# Altium project Smart Stepper Fin.PrjPcb
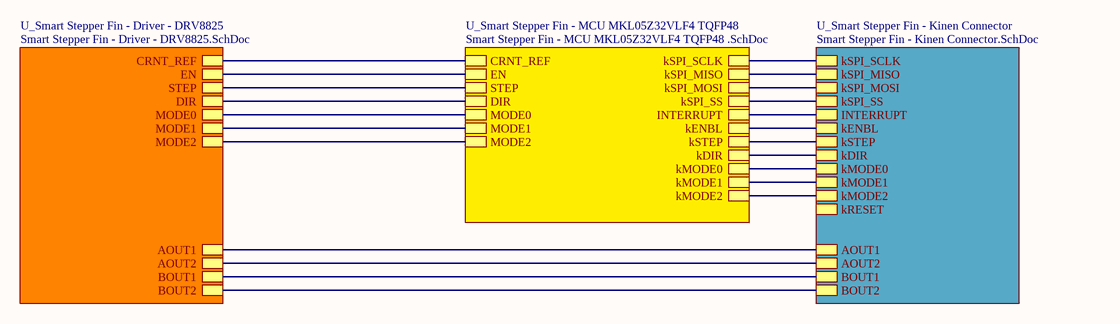
[diagram p0: Smart Stepper Fin - System.SchDoc]
4 sheets, 30 parts. Net scope: hierarchical (ports join the sheet entries above them; power ports are global).
Board file: Smart Stepper Fin R1.0.PcbDoc
Sheets:
  Smart Stepper Fin - System.SchDoc
    U_Smart Stepper Fin - Driver - DRV8825 = Smart Stepper Fin - Driver - DRV8825.SchDoc
    U_Smart Stepper Fin - MCU MKL05Z32VLF4 TQFP48 = Smart Stepper Fin - MCU MKL05Z32VLF4 TQFP48 .SchDoc
    U_Smart Stepper Fin - Kinen Connector = Smart Stepper Fin - Kinen Connector.SchDoc

## Sheet Smart Stepper Fin - System.SchDoc
size A

### Sub-sheets
U_Smart Stepper Fin - Driver - DRV8825 = Smart Stepper Fin - Driver - DRV8825.SchDoc: AOUT1, AOUT2, BOUT1, BOUT2, CRNT_REF, EN, STEP, DIR, MODE0, MODE1, MODE2
U_Smart Stepper Fin - Kinen Connector = Smart Stepper Fin - Kinen Connector.SchDoc: AOUT1, AOUT2, BOUT1, BOUT2, kRESET, kENBL, kSTEP, kDIR, kMODE0, kMODE1, kMODE2, INTERRUPT, kSPI_MOSI, kSPI_MISO, kSPI_SCLK, kSPI_SS
U_Smart Stepper Fin - MCU MKL05Z32VLF4 TQFP48 = Smart Stepper Fin - MCU MKL05Z32VLF4 TQFP48 .SchDoc: CRNT_REF, EN, STEP, DIR, MODE0, MODE1, MODE2, INTERRUPT, kSPI_MOSI, kSPI_MISO, kSPI_SCLK, kSPI_SS, kENBL, kSTEP, kDIR, kMODE0, kMODE1, kMODE2

### Nets
AOUT1: sheet U_Smart Stepper Fin - Driver - DRV8825/AOUT1, sheet U_Smart Stepper Fin - Kinen Connector/AOUT1
AOUT2: sheet U_Smart Stepper Fin - Driver - DRV8825/AOUT2, sheet U_Smart Stepper Fin - Kinen Connector/AOUT2
BOUT1: sheet U_Smart Stepper Fin - Driver - DRV8825/BOUT1, sheet U_Smart Stepper Fin - Kinen Connector/BOUT1
BOUT2: sheet U_Smart Stepper Fin - Driver - DRV8825/BOUT2, sheet U_Smart Stepper Fin - Kinen Connector/BOUT2
kSPI_MISO: sheet U_Smart Stepper Fin - MCU MKL05Z32VLF4 TQFP48/kSPI_MISO, sheet U_Smart Stepper Fin - Kinen Connector/kSPI_MISO
kSPI_MOSI: sheet U_Smart Stepper Fin - MCU MKL05Z32VLF4 TQFP48/kSPI_MOSI, sheet U_Smart Stepper Fin - Kinen Connector/kSPI_MOSI
NetKINEN1_1: sheet U_Smart Stepper Fin - MCU MKL05Z32VLF4 TQFP48/kSPI_SS, sheet U_Smart Stepper Fin - Kinen Connector/kSPI_SS
NetKINEN1_3: sheet U_Smart Stepper Fin - MCU MKL05Z32VLF4 TQFP48/kSPI_SCLK, sheet U_Smart Stepper Fin - Kinen Connector/kSPI_SCLK
NetKINEN1_14: sheet U_Smart Stepper Fin - MCU MKL05Z32VLF4 TQFP48/INTERRUPT, sheet U_Smart Stepper Fin - Kinen Connector/INTERRUPT
NetKINEN1_15: sheet U_Smart Stepper Fin - MCU MKL05Z32VLF4 TQFP48/kSTEP, sheet U_Smart Stepper Fin - Kinen Connector/kSTEP
NetKINEN1_16: sheet U_Smart Stepper Fin - MCU MKL05Z32VLF4 TQFP48/kDIR, sheet U_Smart Stepper Fin - Kinen Connector/kDIR
NetKINEN1_17: sheet U_Smart Stepper Fin - MCU MKL05Z32VLF4 TQFP48/kENBL, sheet U_Smart Stepper Fin - Kinen Connector/kENBL
NetKINEN1_18: sheet U_Smart Stepper Fin - MCU MKL05Z32VLF4 TQFP48/kMODE0, sheet U_Smart Stepper Fin - Kinen Connector/kMODE0
NetKINEN1_19: sheet U_Smart Stepper Fin - MCU MKL05Z32VLF4 TQFP48/kMODE1, sheet U_Smart Stepper Fin - Kinen Connector/kMODE1
NetKINEN1_21: sheet U_Smart Stepper Fin - MCU MKL05Z32VLF4 TQFP48/kMODE2, sheet U_Smart Stepper Fin - Kinen Connector/kMODE2
NetR2_2: sheet U_Smart Stepper Fin - Driver - DRV8825/CRNT_REF, sheet U_Smart Stepper Fin - MCU MKL05Z32VLF4 TQFP48/CRNT_REF
NetR3_2: sheet U_Smart Stepper Fin - Driver - DRV8825/MODE2, sheet U_Smart Stepper Fin - MCU MKL05Z32VLF4 TQFP48/MODE2
NetU1_20: sheet U_Smart Stepper Fin - Driver - DRV8825/DIR, sheet U_Smart Stepper Fin - MCU MKL05Z32VLF4 TQFP48/DIR
NetU1_21: sheet U_Smart Stepper Fin - Driver - DRV8825/EN, sheet U_Smart Stepper Fin - MCU MKL05Z32VLF4 TQFP48/EN
NetU1_22: sheet U_Smart Stepper Fin - Driver - DRV8825/STEP, sheet U_Smart Stepper Fin - MCU MKL05Z32VLF4 TQFP48/STEP
NetU1_24: sheet U_Smart Stepper Fin - Driver - DRV8825/MODE0, sheet U_Smart Stepper Fin - MCU MKL05Z32VLF4 TQFP48/MODE0
NetU1_25: sheet U_Smart Stepper Fin - Driver - DRV8825/MODE1, sheet U_Smart Stepper Fin - MCU MKL05Z32VLF4 TQFP48/MODE1

## Sheet Smart Stepper Fin - Driver - DRV8825.SchDoc
size A
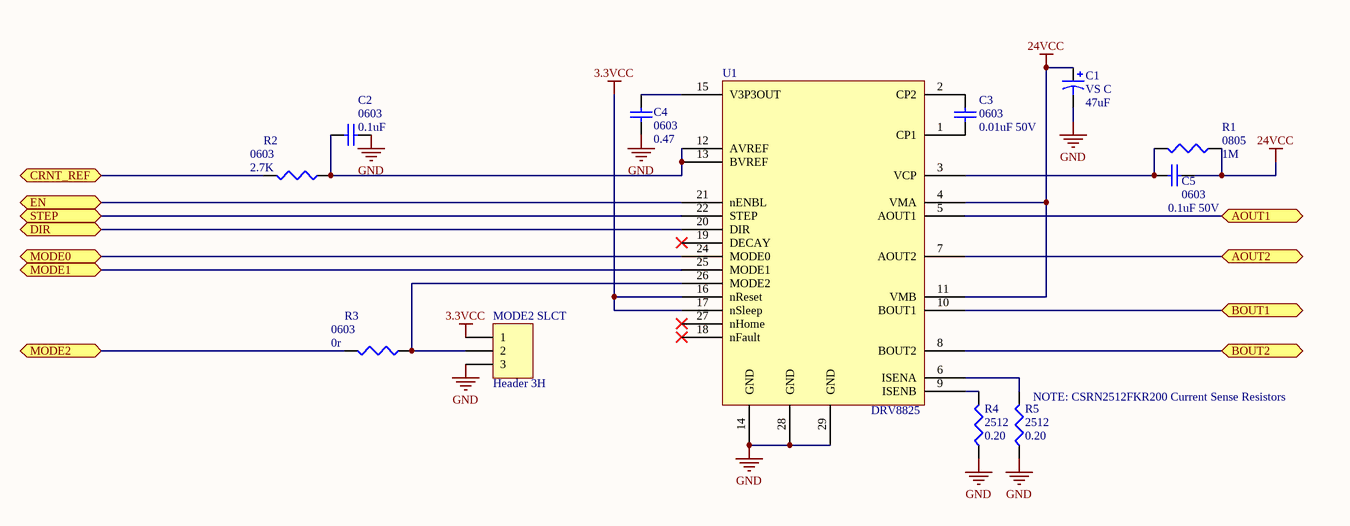
[diagram p1: Smart Stepper Fin - Driver - DRV8825.SchDoc]

### Parts
C1  VS C  value 47uF  [Panasonic VS C]
C2  0603  value 0.1uF  [1608[0603]]
C3  0603  value 0.01uF 50V  [1608[0603]]
C4  0603  value 0.47  [1608[0603]]
C5  0603  value 0.1uF 50V  [1608[0603]]
MODE2_SLCT  Header 3H  [HDR1X3H]
R1  0805  value 1M  [J1-0603]
R2  0603  value 2.7K  [J1-0603]
R3  0603  value 0r  [J1-0603]
R4  2512  value 0.20  [Resistor2512]
R5  2512  value 0.20  [Resistor2512]
U1  DRV8825  [DRV8825]

### Ports
AOUT1, AOUT2, BOUT1, BOUT2, CRNT_REF, DIR, EN, MODE0, MODE1, MODE2, STEP

### Nets
3.3VCC: MODE2_SLCT.1 U1.16(nReset) U1.17(nSleep)
24VCC: C1.1 C5.1 R1.1 U1.4(VMA) U1.11(VMB)
GND: C1.2 C2.1 C4.1 MODE2_SLCT.3 R4.1 R5.1 U1.14(GND) U1.28(GND) U1.29(GND)
AOUT1: U1.5(AOUT1) ; port AOUT1
AOUT2: U1.7(AOUT2) ; port AOUT2
BOUT1: U1.10(BOUT1) ; port BOUT1
BOUT2: U1.8(BOUT2) ; port BOUT2
NetC2_2: C2.2 R2.1 U1.12(AVREF) U1.13(BVREF)
NetC3_1: C3.1 U1.1(CP1)
NetC3_2: C3.2 U1.2(CP2)
NetC4_2: C4.2 U1.15(V3P3OUT)
NetC5_2: C5.2 R1.2 U1.3(VCP)
NetMODE2_SLCT_2: MODE2_SLCT.2 R3.1 U1.26(MODE2)
NetR2_2: R2.2 ; port CRNT_REF
NetR3_2: R3.2 ; port MODE2
NetR4_2: R4.2 U1.9(ISENB)
NetR5_2: R5.2 U1.6(ISENA)
NetU1_20: U1.20(DIR) ; port DIR
NetU1_21: U1.21(nENBL) ; port EN
NetU1_22: U1.22(STEP) ; port STEP
NetU1_24: U1.24(MODE0) ; port MODE0
NetU1_25: U1.25(MODE1) ; port MODE1

Not connected (* = marked no-connect by the designer): U1 18(nFault)* 19(DECAY)* 23(NC) 27(nHome)*

### Notes on the sheet
- (near R5) NOTE: CSRN2512FKR200 Current Sense Resistors

### Library data of the parts
C1 = Cap Pol1: Polarized Capacitor (Radial); Published: 8-Jun-2000; LatestRevisionDate: 17-Jul-2002; LatestRevisionNote: Re-released for DXP Platform.; PackageReference: RB7.6-15; Publisher: Altium Limited; PackageDescription: Polarized Capacitor (Radial); 2 Leads
C2-C5 = Cap Semi: Capacitor (Semiconductor SIM Model); Published: 8-Jun-2000; LatestRevisionDate: 29-May-2009; LatestRevisionNote: IPC-7351 Footprint Added.; PackageReference: C1206; Publisher: Altium Limited; PackageDescription: Chip Capacitor
MODE2_SLCT = Header 3H: Header, 3-Pin, Right Angle; LatestRevisionDate: 17-Jul-2002; LatestRevisionNote: Re-released for DXP Platform.; Publisher: Altium Limited
R1-R5 = Res3: Resistor; Published: 8-Jun-2000; LatestRevisionDate: 29-May-2009; LatestRevisionNote: IPC-7351 Footprint Added.; PackageReference: J1-0603; Publisher: Altium Limited; PackageDescription: Chip Resistor
U1 = DRV8825: DRV8825 Ti Stepper Driver

## Sheet Smart Stepper Fin - MCU MKL05Z32VLF4 TQFP48 .SchDoc
size A
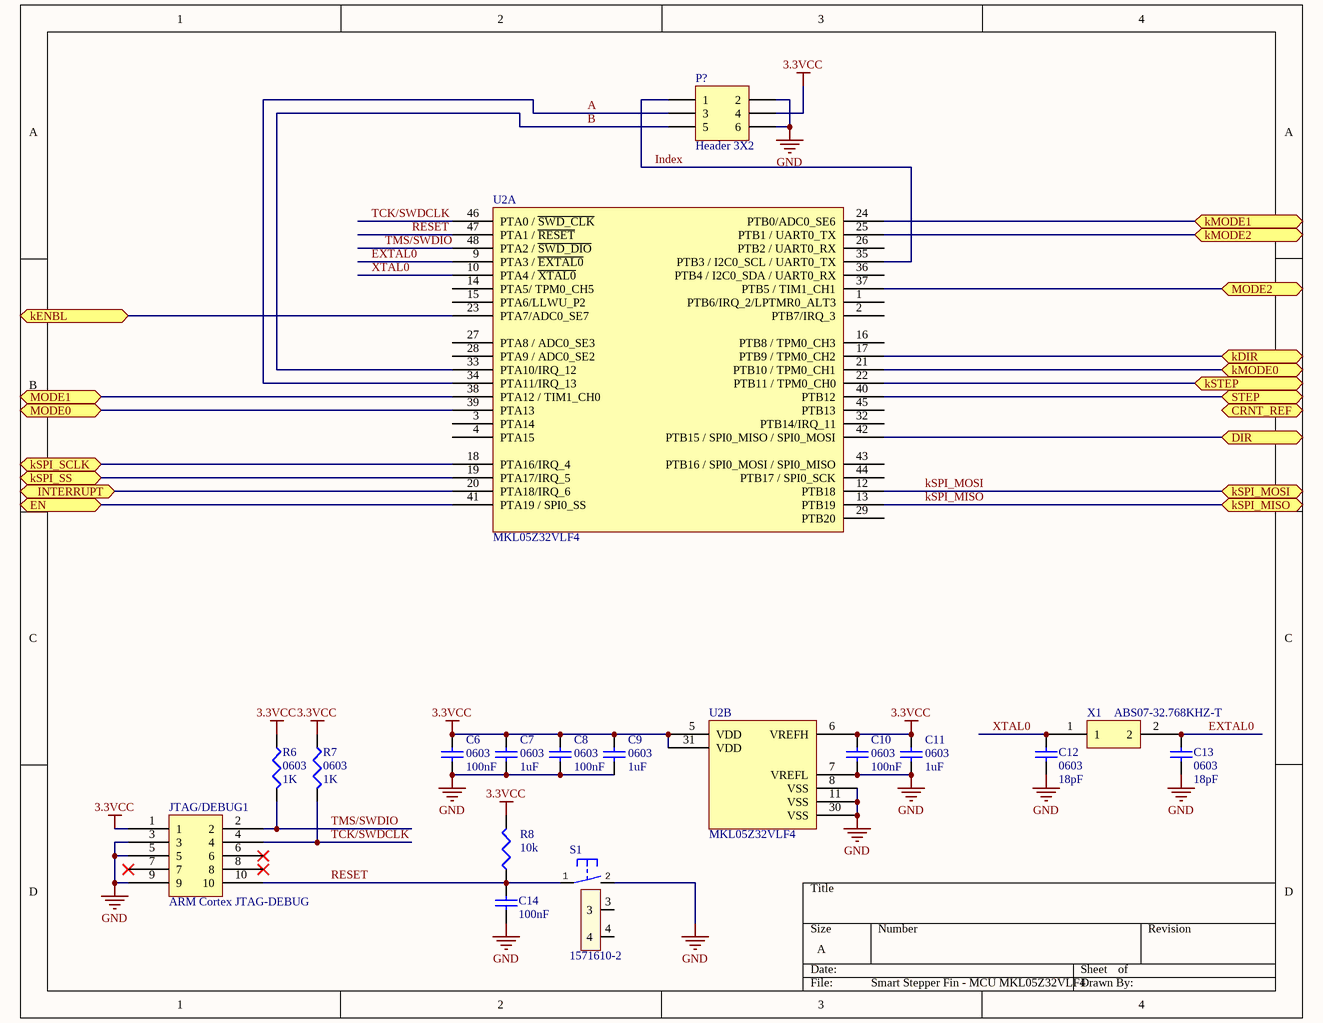
[diagram p2: Smart Stepper Fin - MCU MKL05Z32VLF4 TQFP48 .SchDoc]

### Parts
C6  0603  value 100nF  [1608[0603]]
C7  0603  value 1uF  [1608[0603]]
C8  0603  value 100nF  [1608[0603]]
C9  0603  value 1uF  [1608[0603]]
C10  0603  value 100nF  [1608[0603]]
C11  0603  value 1uF  [1608[0603]]
C12  0603  value 18pF  [1608[0603]]
C13  0603  value 18pF  [1608[0603]]
C14  value 100nF  [1608[0603]]  (hidden comment: Cap Semi)
ENC  Header 3X2  [HDR2X3 Shrouded - Molex 0901301106]
JTAG/DEBUG1  ARM Cortex JTAG-DEBUG  [FTSH-105-XX-X-DV]
R6  0603  value 1K  [J1-0603]
R7  0603  value 1K  [J1-0603]
R8  value 10k  [J1-0603]  (hidden comment: Res3)
S1  1571610-2  [B3F-31XX]
U2  MKL05Z32VLF4  [MKL05Z32VLF4]  (parts A,B of 2)
X1  ABS07-32.768KHZ-T  [ABS07-32.768KHZ-T]

### Ports
CRNT_REF, DIR, EN, INTERRUPT, kDIR, kENBL, kMODE0, kMODE1, kMODE2, kSPI_MISO, kSPI_MOSI, kSPI_SCLK, kSPI_SS, kSTEP, MODE0, MODE1, MODE2, STEP

### Nets
3.3VCC: C6.2 C7.2 C8.2 C9.2 C10.1 C11.1 ENC.4 JTAG/DEBUG1.1 R6.1 R7.1 R8.2 U2.5(VDD) U2.6(VREFH) U2.31(VDD)
GND: C6.1 C7.1 C8.1 C9.1 C10.2 C11.2 C12.2 C13.2 C14.1 ENC.2 ENC.6 JTAG/DEBUG1.3 JTAG/DEBUG1.5 JTAG/DEBUG1.9 S1.2(S) U2.7(VREFL) U2.8(VSS) U2.11(VSS) U2.30(VSS)
A: ENC.3 U2.34(PTA11/IRQ_13)
B: ENC.5 U2.33(PTA10/IRQ_12)
EXTAL0: C13.1 U2.9(PTA3_/_~{EXTAL0}) X1.2
Index: ENC.1 U2.35(PTB3_/_I2C0_SCL_/_UART0_TX)
kSPI_MISO: U2.13(PTB19) ; port kSPI_MISO
kSPI_MOSI: U2.12(PTB18) ; port kSPI_MOSI
RESET: C14.2 JTAG/DEBUG1.10 R8.1 S1.1(P) U2.47(PTA1_/_~{RESET})
TCK/SWDCLK: JTAG/DEBUG1.4 R7.2 U2.46(PTA0_/_~{SWD_CLK})
TMS/SWDIO: JTAG/DEBUG1.2 R6.2 U2.48(PTA2_/_~{SWD_DIO})
XTAL0: C12.1 U2.10(PTA4_/_~{XTAL0}) X1.1
NetKINEN1_1: U2.19(PTA17/IRQ_5) ; port kSPI_SS
NetKINEN1_3: U2.18(PTA16/IRQ_4) ; port kSPI_SCLK
NetKINEN1_14: U2.20(PTA18/IRQ_6) ; port INTERRUPT
NetKINEN1_15: U2.22(PTB11_/_TPM0_CH0) ; port kSTEP
NetKINEN1_16: U2.17(PTB9_/_TPM0_CH2) ; port kDIR
NetKINEN1_17: U2.23(PTA7/ADC0_SE7) ; port kENBL
NetKINEN1_18: U2.21(PTB10_/_TPM0_CH1) ; port kMODE0
NetKINEN1_19: U2.24(PTB0/ADC0_SE6) ; port kMODE1
NetKINEN1_21: U2.25(PTB1_/_UART0_TX) ; port kMODE2
NetR3_2: U2.37(PTB5_/_TIM1_CH1) ; port MODE2
NetU1_20: U2.42(PTB15_/_SPI0_MISO_/_SPI0_MOSI) ; port DIR
NetU1_21: U2.41(PTA19_/_SPI0_SS) ; port EN
NetU1_22: U2.40(PTB12) ; port STEP
NetU1_24: U2.39(PTA13) ; port MODE0
NetU1_25: U2.38(PTA12_/_TIM1_CH0) ; port MODE1

Not connected (* = marked no-connect by the designer): JTAG/DEBUG1 6* 7* 8*; S1 3 4; U2 1(PTB6/IRQ_2/LPTMR0_ALT3) 2(PTB7/IRQ_3) 3(PTA14) 4(PTA15) 14(PTA5/_TPM0_CH5) 15(PTA6/LLWU_P2) 16(PTB8_/_TPM0_CH3) 26(PTB2_/_UART0_RX) 27(PTA8_/_ADC0_SE3) 28(PTA9_/_ADC0_SE2) 29(PTB20) 32(PTB14/IRQ_11) 36(PTB4_/_I2C0_SDA_/_UART0_RX) 43(PTB16_/_SPI0_MOSI_/_SPI0_MISO) 44(PTB17_/_SPI0_SCK) 45(PTB13)

### Library data of the parts
C6-C14 = Cap Semi: Capacitor (Semiconductor SIM Model); Published: 8-Jun-2000; LatestRevisionDate: 29-May-2009; LatestRevisionNote: IPC-7351 Footprint Added.; PackageReference: C1206; Publisher: Altium Limited; PackageDescription: Chip Capacitor
ENC = Header 3X2: Header, 3-Pin, Dual row
JTAG/DEBUG1 = ARM Cortex JTAG-DEBUG Header
R6-R8 = Res3: Resistor; Published: 8-Jun-2000; LatestRevisionDate: 29-May-2009; LatestRevisionNote: IPC-7351 Footprint Added.; PackageReference: J1-0603; Publisher: Altium Limited; PackageDescription: Chip Resistor
S1 = 1571610-2_1: SWTCH Momentary Washable; Manufacturer: Omron; Manufacturer: TE; LastRevisionNote: Import; ComponentLink1URL: http://www.te.com/commerce/DocumentDelivery/DDEController?Action=srchrtrv&DocNm=1571610&DocType=Customer+Drawing&DocLang=English; ComponentLink1Description: Datasheet for B3F-31XX; Published: 23-Apr-2014; Publisher: UltiMachine; LastRevisionDate: 23-Apr-2014; ManufacturerPartNumber: 1571610-2; Supplier 1: Mouser; Supplier Part Number 1: 506-1571610-2
U2 = MKL05Z32VLF4: ARM Cortex M0+
X1 = ABS07-32.768KHZ-T: ABS07-32.768KHZ-T RTC Crystal Oscillator

## Sheet Smart Stepper Fin - Kinen Connector.SchDoc
size A
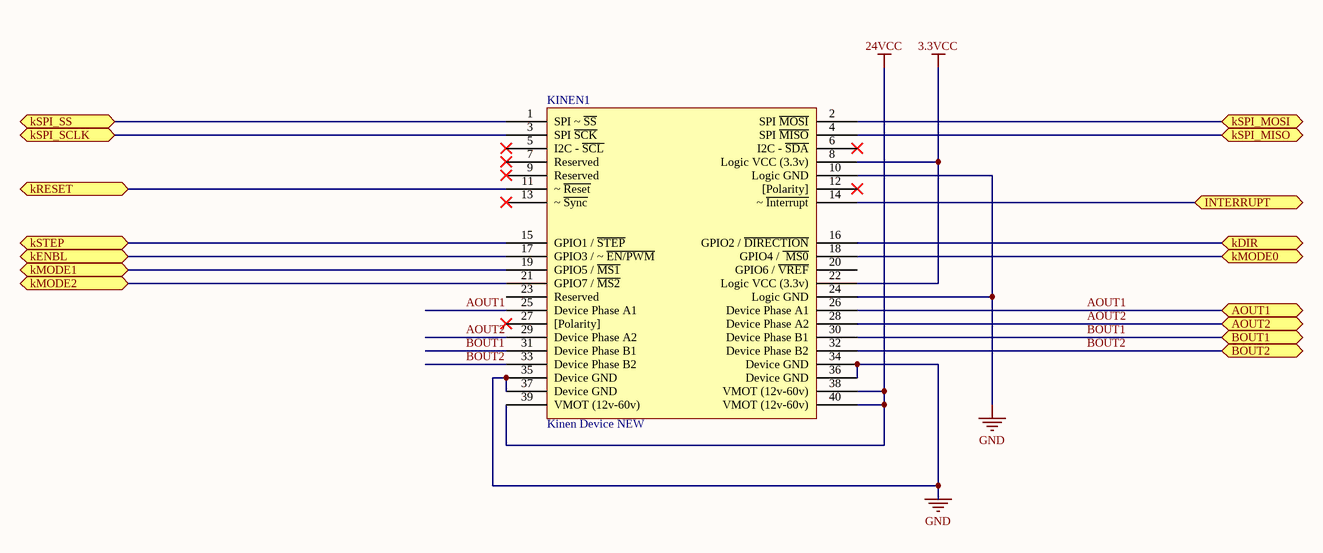
[diagram p3: Smart Stepper Fin - Kinen Connector.SchDoc]

### Parts
KINEN1  Kinen Device NEW  [Kinen Port - Device]

### Ports
AOUT1, AOUT2, BOUT1, BOUT2, INTERRUPT, kDIR, kENBL, kMODE0, kMODE1, kMODE2, kRESET, kSPI_MISO, kSPI_MOSI, kSPI_SCLK, kSPI_SS, kSTEP

### Nets
3.3VCC: KINEN1.8(Logic_VCC_(3.3v)) KINEN1.22(Logic_VCC_(3.3v))
24VCC: KINEN1.38(VMOT_(12v-60v)) KINEN1.39(VMOT_(12v-60v)) KINEN1.40(VMOT_(12v-60v))
GND: KINEN1.10(Logic_GND) KINEN1.24(Logic_GND) KINEN1.34(Device_GND) KINEN1.35(Device_GND) KINEN1.36(Device_GND) KINEN1.37(Device_GND)
AOUT1: KINEN1.25(Device_Phase_A1) KINEN1.26(Device_Phase_A1) ; port AOUT1
AOUT2: KINEN1.28(Device_Phase_A2) KINEN1.29(Device_Phase_A2) ; port AOUT2
BOUT1: KINEN1.30(Device_Phase_B1) KINEN1.31(Device_Phase_B1) ; port BOUT1
BOUT2: KINEN1.32(Device_Phase_B2) KINEN1.33(Device_Phase_B2) ; port BOUT2
kSPI_MISO: KINEN1.4(SPI_~{MISO}) ; port kSPI_MISO
kSPI_MOSI: KINEN1.2(SPI_~{MOSI}) ; port kSPI_MOSI
NetKINEN1_1: KINEN1.1(SPI_~_~{SS}) ; port kSPI_SS
NetKINEN1_3: KINEN1.3(SPI_~{SCK}) ; port kSPI_SCLK
NetKINEN1_11: KINEN1.11(~_~{Reset}) ; port kRESET
NetKINEN1_14: KINEN1.14(~_~{Interrupt}) ; port INTERRUPT
NetKINEN1_15: KINEN1.15(GPIO1_/_~{STEP}) ; port kSTEP
NetKINEN1_16: KINEN1.16(GPIO2_/_~{DIRECTION}) ; port kDIR
NetKINEN1_17: KINEN1.17(GPIO3_/_~_~{EN/PWM}) ; port kENBL
NetKINEN1_18: KINEN1.18(GPIO4_/_~{_MS0}) ; port kMODE0
NetKINEN1_19: KINEN1.19(GPIO5_/_~{MS1}) ; port kMODE1
NetKINEN1_21: KINEN1.21(GPIO7_/_~{MS2}) ; port kMODE2

Not connected (* = marked no-connect by the designer): KINEN1 5(I2C_-_~{SCL})* 6(I2C_-_~{SDA})* 7(Reserved)* 9(Reserved)* 12([Polarity])* 13(~_~{Sync})* 20(GPIO6_/_~{VREF}) 23(Reserved) 27([Polarity])*

## Nets that join several sheets
3.3VCC: Smart Stepper Fin - Driver - DRV8825 (MODE2_SLCT.1 U1.16 U1.17), Smart Stepper Fin - MCU MKL05Z32VLF4 TQFP48  (14 pins), Smart Stepper Fin - Kinen Connector (KINEN1.8 KINEN1.22)
24VCC: Smart Stepper Fin - Driver - DRV8825 (5 pins), Smart Stepper Fin - Kinen Connector (KINEN1.38 KINEN1.39 KINEN1.40)
GND: Smart Stepper Fin - Driver - DRV8825 (9 pins), Smart Stepper Fin - MCU MKL05Z32VLF4 TQFP48  (19 pins), Smart Stepper Fin - Kinen Connector (6 pins)
AOUT1: Smart Stepper Fin - Driver - DRV8825 (U1.5), Smart Stepper Fin - Kinen Connector (KINEN1.25 KINEN1.26)
AOUT2: Smart Stepper Fin - Driver - DRV8825 (U1.7), Smart Stepper Fin - Kinen Connector (KINEN1.28 KINEN1.29)
BOUT1: Smart Stepper Fin - Driver - DRV8825 (U1.10), Smart Stepper Fin - Kinen Connector (KINEN1.30 KINEN1.31)
BOUT2: Smart Stepper Fin - Driver - DRV8825 (U1.8), Smart Stepper Fin - Kinen Connector (KINEN1.32 KINEN1.33)
kSPI_MISO: Smart Stepper Fin - MCU MKL05Z32VLF4 TQFP48  (U2.13), Smart Stepper Fin - Kinen Connector (KINEN1.4)
kSPI_MOSI: Smart Stepper Fin - MCU MKL05Z32VLF4 TQFP48  (U2.12), Smart Stepper Fin - Kinen Connector (KINEN1.2)
NetKINEN1_1: Smart Stepper Fin - MCU MKL05Z32VLF4 TQFP48  (U2.19), Smart Stepper Fin - Kinen Connector (KINEN1.1)
NetKINEN1_3: Smart Stepper Fin - MCU MKL05Z32VLF4 TQFP48  (U2.18), Smart Stepper Fin - Kinen Connector (KINEN1.3)
NetKINEN1_14: Smart Stepper Fin - MCU MKL05Z32VLF4 TQFP48  (U2.20), Smart Stepper Fin - Kinen Connector (KINEN1.14)
NetKINEN1_15: Smart Stepper Fin - MCU MKL05Z32VLF4 TQFP48  (U2.22), Smart Stepper Fin - Kinen Connector (KINEN1.15)
NetKINEN1_16: Smart Stepper Fin - MCU MKL05Z32VLF4 TQFP48  (U2.17), Smart Stepper Fin - Kinen Connector (KINEN1.16)
NetKINEN1_17: Smart Stepper Fin - MCU MKL05Z32VLF4 TQFP48  (U2.23), Smart Stepper Fin - Kinen Connector (KINEN1.17)
NetKINEN1_18: Smart Stepper Fin - MCU MKL05Z32VLF4 TQFP48  (U2.21), Smart Stepper Fin - Kinen Connector (KINEN1.18)
NetKINEN1_19: Smart Stepper Fin - MCU MKL05Z32VLF4 TQFP48  (U2.24), Smart Stepper Fin - Kinen Connector (KINEN1.19)
NetKINEN1_21: Smart Stepper Fin - MCU MKL05Z32VLF4 TQFP48  (U2.25), Smart Stepper Fin - Kinen Connector (KINEN1.21)
NetR3_2: Smart Stepper Fin - Driver - DRV8825 (R3.2), Smart Stepper Fin - MCU MKL05Z32VLF4 TQFP48  (U2.37)
NetU1_20: Smart Stepper Fin - Driver - DRV8825 (U1.20), Smart Stepper Fin - MCU MKL05Z32VLF4 TQFP48  (U2.42)
NetU1_21: Smart Stepper Fin - Driver - DRV8825 (U1.21), Smart Stepper Fin - MCU MKL05Z32VLF4 TQFP48  (U2.41)
NetU1_22: Smart Stepper Fin - Driver - DRV8825 (U1.22), Smart Stepper Fin - MCU MKL05Z32VLF4 TQFP48  (U2.40)
NetU1_24: Smart Stepper Fin - Driver - DRV8825 (U1.24), Smart Stepper Fin - MCU MKL05Z32VLF4 TQFP48  (U2.39)
NetU1_25: Smart Stepper Fin - Driver - DRV8825 (U1.25), Smart Stepper Fin - MCU MKL05Z32VLF4 TQFP48  (U2.38)